# Altium schematic sheet CP2102_WQFN-28(5x5).schdoc
size 127 x 101 mm
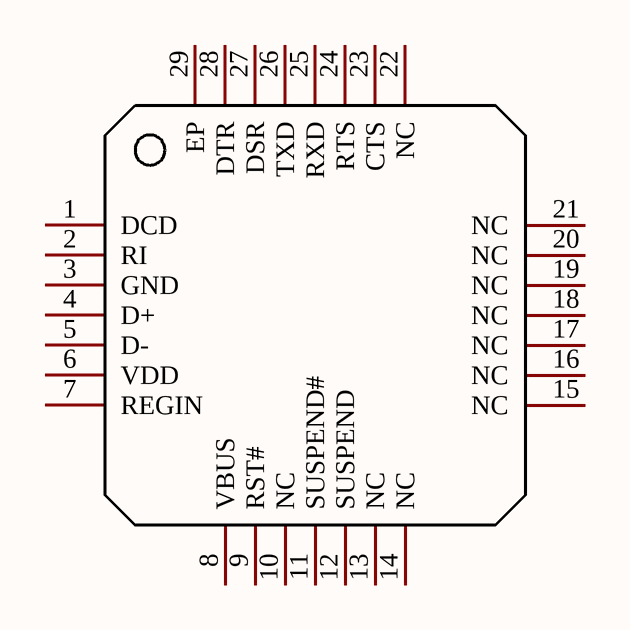
[diagram p0: CP2102_WQFN-28(5x5).schdoc]

## Parts
U?  CP2102-GMR  [WQFN-28_L5.0-W5.0-P0.50-BL-EP3.2]  (value not drawn)

## Nets

Not connected (* = marked no-connect by the designer): U? 1(DCD) 2(RI) 3(GND) 4(D+) 5(D-) 6(VDD) 7(REGIN) 8(VBUS) 9(RST#) 10(NC) 11(SUSPEND#) 12(SUSPEND) 13(NC) 14(NC) 15(NC) 16(NC) 17(NC) 18(NC) 19(NC) 20(NC) 21(NC) 22(NC) 23(CTS) 24(RTS) 25(RXD) 26(TXD) 27(DSR) 28(DTR) 29(EP)

## Library data of the parts
U? = CP2102-GMR: Manufacturer: SKYWORKS/SILICON LABS(芯科); Add into BOM: yes; Applications Function: 收发器; Protocol: USB; Supply Voltage: 3V~3.6V; Data Rate: 1Mbps; Symbol: CP2102-GMR; Device: CP2102-GMR; LCSC Part Name: CP2102-GMR; Supplier Part: C6568; Manufacturer Part: CP2102-GMR; Supplier Footprint: WQFN-28-EP(5x5); JLCPCB Part Class: Extended Part; Datasheet: https://atta.szlcsc.com/upload/public/pdf/source/20170103/1483439882795.pdf; Supplier: LCSC; Convert to PCB: yes